# Altium schematic sheet PiAttachment.SchDoc
size A4
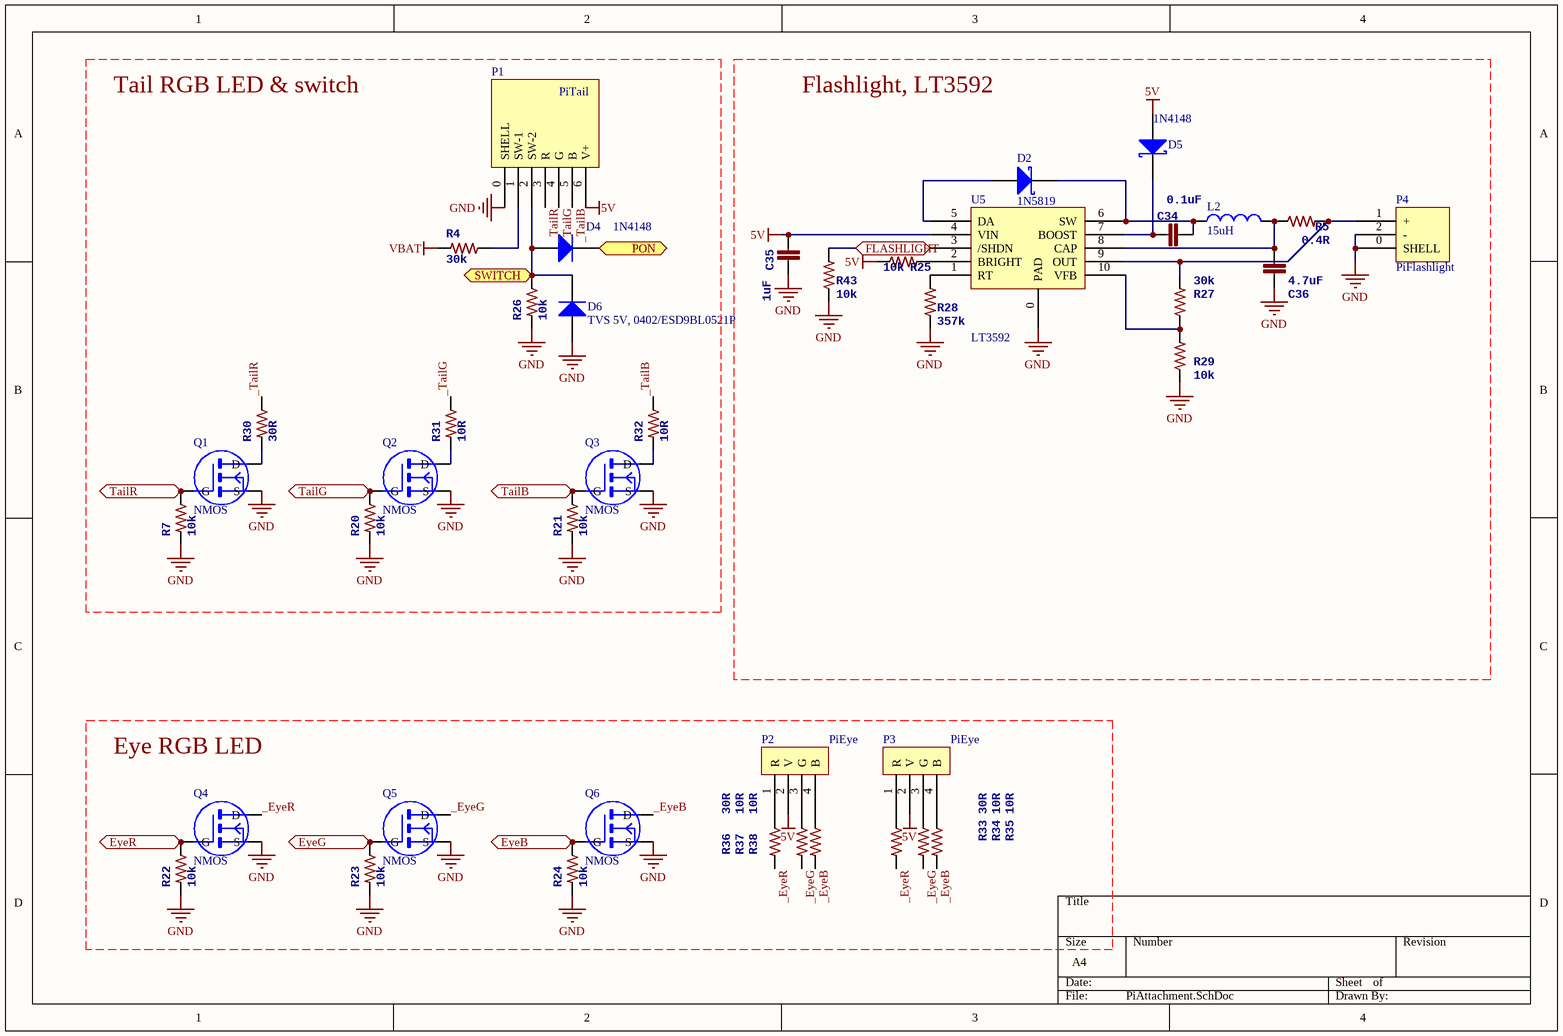
[diagram p0: PiAttachment.SchDoc]

## Parts
C34  0.1uF  [0402]
C35  1uF  [0402]
C36  4.7uF  [0805]
D2  1N5819  [SOD-123]
D4  1N4148  [LC-SOD-323]
D5  1N4148  [SOD-123]
D6  TVS 5V, 0402/ESD9BL0521P  [0402]
L2  value 15uH  [L3521]  (hidden comment: Inductor)
P1  PiTail  [FPC-0.5mm-6]
P2  PiEye  [PiEyeLED]
P3  PiEye  [PiEyeLED]
P4  PiFlashlight  [PiFlashLight]
Q1  NMOS  [SOT23_L]
Q2  NMOS  [SOT23_L]
Q3  NMOS  [SOT23_L]
Q4  NMOS  [SOT23_L]
Q5  NMOS  [SOT23_L]
Q6  NMOS  [SOT23_L]
R4  30k  [0402]
R5  0.4R  [0603]
R7  10k  [0402]
R20  10k  [0402]
R21  10k  [0402]
R22  10k  [0402]
R23  10k  [0402]
R24  10k  [0402]
R25  10k  [0402]
R26  10k  [0402]
R27  30k  [0402]
R28  357k  [0402]
R29  10k  [0402]
R30  30R  [0603]
R31  10R  [0603]
R32  10R  [0603]
R33  30R  [0603]
R34  10R  [0603]
R35  10R  [0603]
R36  30R  [0603]
R37  10R  [0603]
R38  10R  [0603]
R43  10k  [0402]
U5  LT3592  [LT3592]

## Ports
EyeB, EyeG, EyeR, FLASHLIGHT, PON, SWITCH, TailB, TailG, TailR

## Nets
5V: C35.1 D5.3(A) P1.6(V+) P2.2(V) P3.2(V) R25.1 U5.4(VIN)
GND: C35.2 C36.2 D6.1(A) P1.0(SHELL) P4.0(SHELL) P4.2(-) Q1.S Q2.S Q3.S Q4.S Q5.S Q6.S R7.2 R20.2 R21.2 R22.2 R23.2 R24.2 R26.2 R28.1 R29.1 R43.1 U5.0(PAD)
VBAT: R4.2
_EyeB: Q6.D R35.2 R38.2
_EyeG: Q5.D R34.2 R37.2
_EyeR: Q4.D R33.2 R36.2
_TailB: P1.5(B) R32.1
_TailG: P1.4(G) R31.1
_TailR: P1.3(R) R30.1
EyeB: Q6.G R24.1 ; port EyeB
EyeG: Q5.G R23.1 ; port EyeG
EyeR: Q4.G R22.1 ; port EyeR
FLASHLIGHT: R43.2 U5.3(/SHDN) ; port FLASHLIGHT
PON: D4.2(K) ; port PON
SWITCH: D4.1(A) D6.2(K) P1.2(SW-2) R26.1 ; port SWITCH
TailB: Q3.G R21.1 ; port TailB
TailG: Q2.G R20.1 ; port TailG
TailR: Q1.G R7.1 ; port TailR
NetC34_1: C34.1 D2.1(K) L2.1 U5.6(SW)
NetC34_2: C34.2 D5.1(K) U5.7(BOOST)
NetC36_1: C36.1 L2.2 R5.1 U5.8(CAP)
NetD2_3: D2.3(A) U5.5(DA)
NetP1_1: P1.1(SW-1) R4.1
NetP2_1: P2.1(R) R36.1
NetP2_3: P2.3(G) R37.1
NetP2_4: P2.4(B) R38.1
NetP3_1: P3.1(R) R33.1
NetP3_3: P3.3(G) R34.1
NetP3_4: P3.4(B) R35.1
NetP4_1: P4.1(+) R5.2 R27.2 U5.9(OUT)
NetQ1_D: Q1.D R30.2
NetQ2_D: Q2.D R31.2
NetQ3_D: Q3.D R32.2
NetR25_2: R25.2 U5.2(BRIGHT)
NetR27_1: R27.1 R29.2 U5.10(VFB)
NetR28_2: R28.2 U5.1(RT)

## Notes on the sheet
- Tail RGB LED & switch
- Flashlight, LT3592
- Eye RGB LED

## Library data of the parts
C34-C36 = CAP0402-CAP: <b>Capacitor</b> / Standard 0603 ceramic capacitor, and 0.1" leaded capacitor.; PARTNO: CC0402ZRY5V7BB104
D2 D5 = Diode 10TQ035: Schottky Rectifier; Note: Terminal 2 is the TAB and is electrically connected to the cathode; Published: 8-Jun-2000; LatestRevisionDate: 17-Jul-2002; LatestRevisionNote: Re-released for DXP Platform.; DatasheetVersion: PD-2.057B; PackageVersion: Feb-1998; PackageReference: TO-220AC; Publisher: Altium Limited; PackageDescription: TO, Thru-Hole, Vertical, Heatsink Mounted; 3 In-Line Leads (1 Absent); Pitch 2.54 mm; ComponentLink1Description: Manufacturer Link; ComponentLink1URL: http://www.irf.com/; ComponentLink2Description: Datasheet; ComponentLink2URL: http://www.irf.com/product-info/datasheets/data/10tq.pdf
D4 D6 = Diode 1N4148: High Conductance Fast Diode; Published: 8-Jun-2000; LatestRevisionDate: 17-Jul-2002; LatestRevisionNote: Re-released for DXP Platform.; DatasheetVersion: 1997; PackageReference: DO-35; Publisher: Altium Limited; PackageDescription: Diode, Axial; Body 3.8 x 1.9 mm (LxDia. max), Lead Dia. 0.53 mm (max); Code_JEDEC: DO-204-AH; ComponentLink1Description: Manufacturer Link; ComponentLink1URL: http://www.fairchildsemi.com/; ComponentLink2Description: Datasheet; ComponentLink2URL: http://www.fairchildsemi.com/ds/1N%2F1N4148.pdf
L2 = Inductor: Code_IEC: 1005; Published: 8-Jun-2000; LatestRevisionDate: 29-May-2009; LatestRevisionNote: IPC-7351 Footprint Added.; PackageReference: 0402-A; Publisher: Altium Limited; PackageDescription: Chip Inductor; Code_JEITA: 0402
Q1-Q6 = NMOS: pin to pad: D>1 G>3 S>2
R4 R5 R7 R20-R38 R43 = RESISTOR0402-RES: <b>Resistor</b> / Basic schematic elements and footprints for 0603, 1206, and PTH 1/10th watt (small) resistors.; PARTNO: RMCF0402FT453K